# Altium project TI Project.PrjPCB (part 2 of 4)

## Sheet Monitoring & CB.SchDoc
size 431 x 279 mm; Date: Not shown in title block; ApprovedBy: Not shown in title block; CheckedBy: Not shown in title block; Author: Not shown in title block; CompanyName: Not shown in title block; Engineer: Not shown in title block; Organization: Not shown in title block; Address1: Not shown in title block; Address2: Not shown in title block; Address3: Not shown in title block; Address4: Not shown in title block; DocumentNumber: 1; Revision: Use project parameter SCH_Rev; SheetNumber: 2; SheetTotal: 3; PageSetup: Record=PageOptions|CenterHorizontal=True|CenterVertical=True|PrintScale=1.00|XCorrection=1.00|YCorrection=1.00|PrintKind=0|BorderSize=5000000|LeftOffset=0|BottomOffset=0|Orientation=2|PaperLength=1000|PaperWidth=1000|Scale=100|PaperSource=15|PrintQuality=600|MediaType=1|DitherType=10|PaperKind=Letter|PrintScaleMode=1; CurrentTime: Not shown in title block; CurrentDate: Not shown in title block; Time: Not shown in title block; DocumentFullPathAndName: Not shown in title block; DocumentName: Not shown in title block; ModifiedDate: Not shown in title block; ImagePath: Not shown in title block
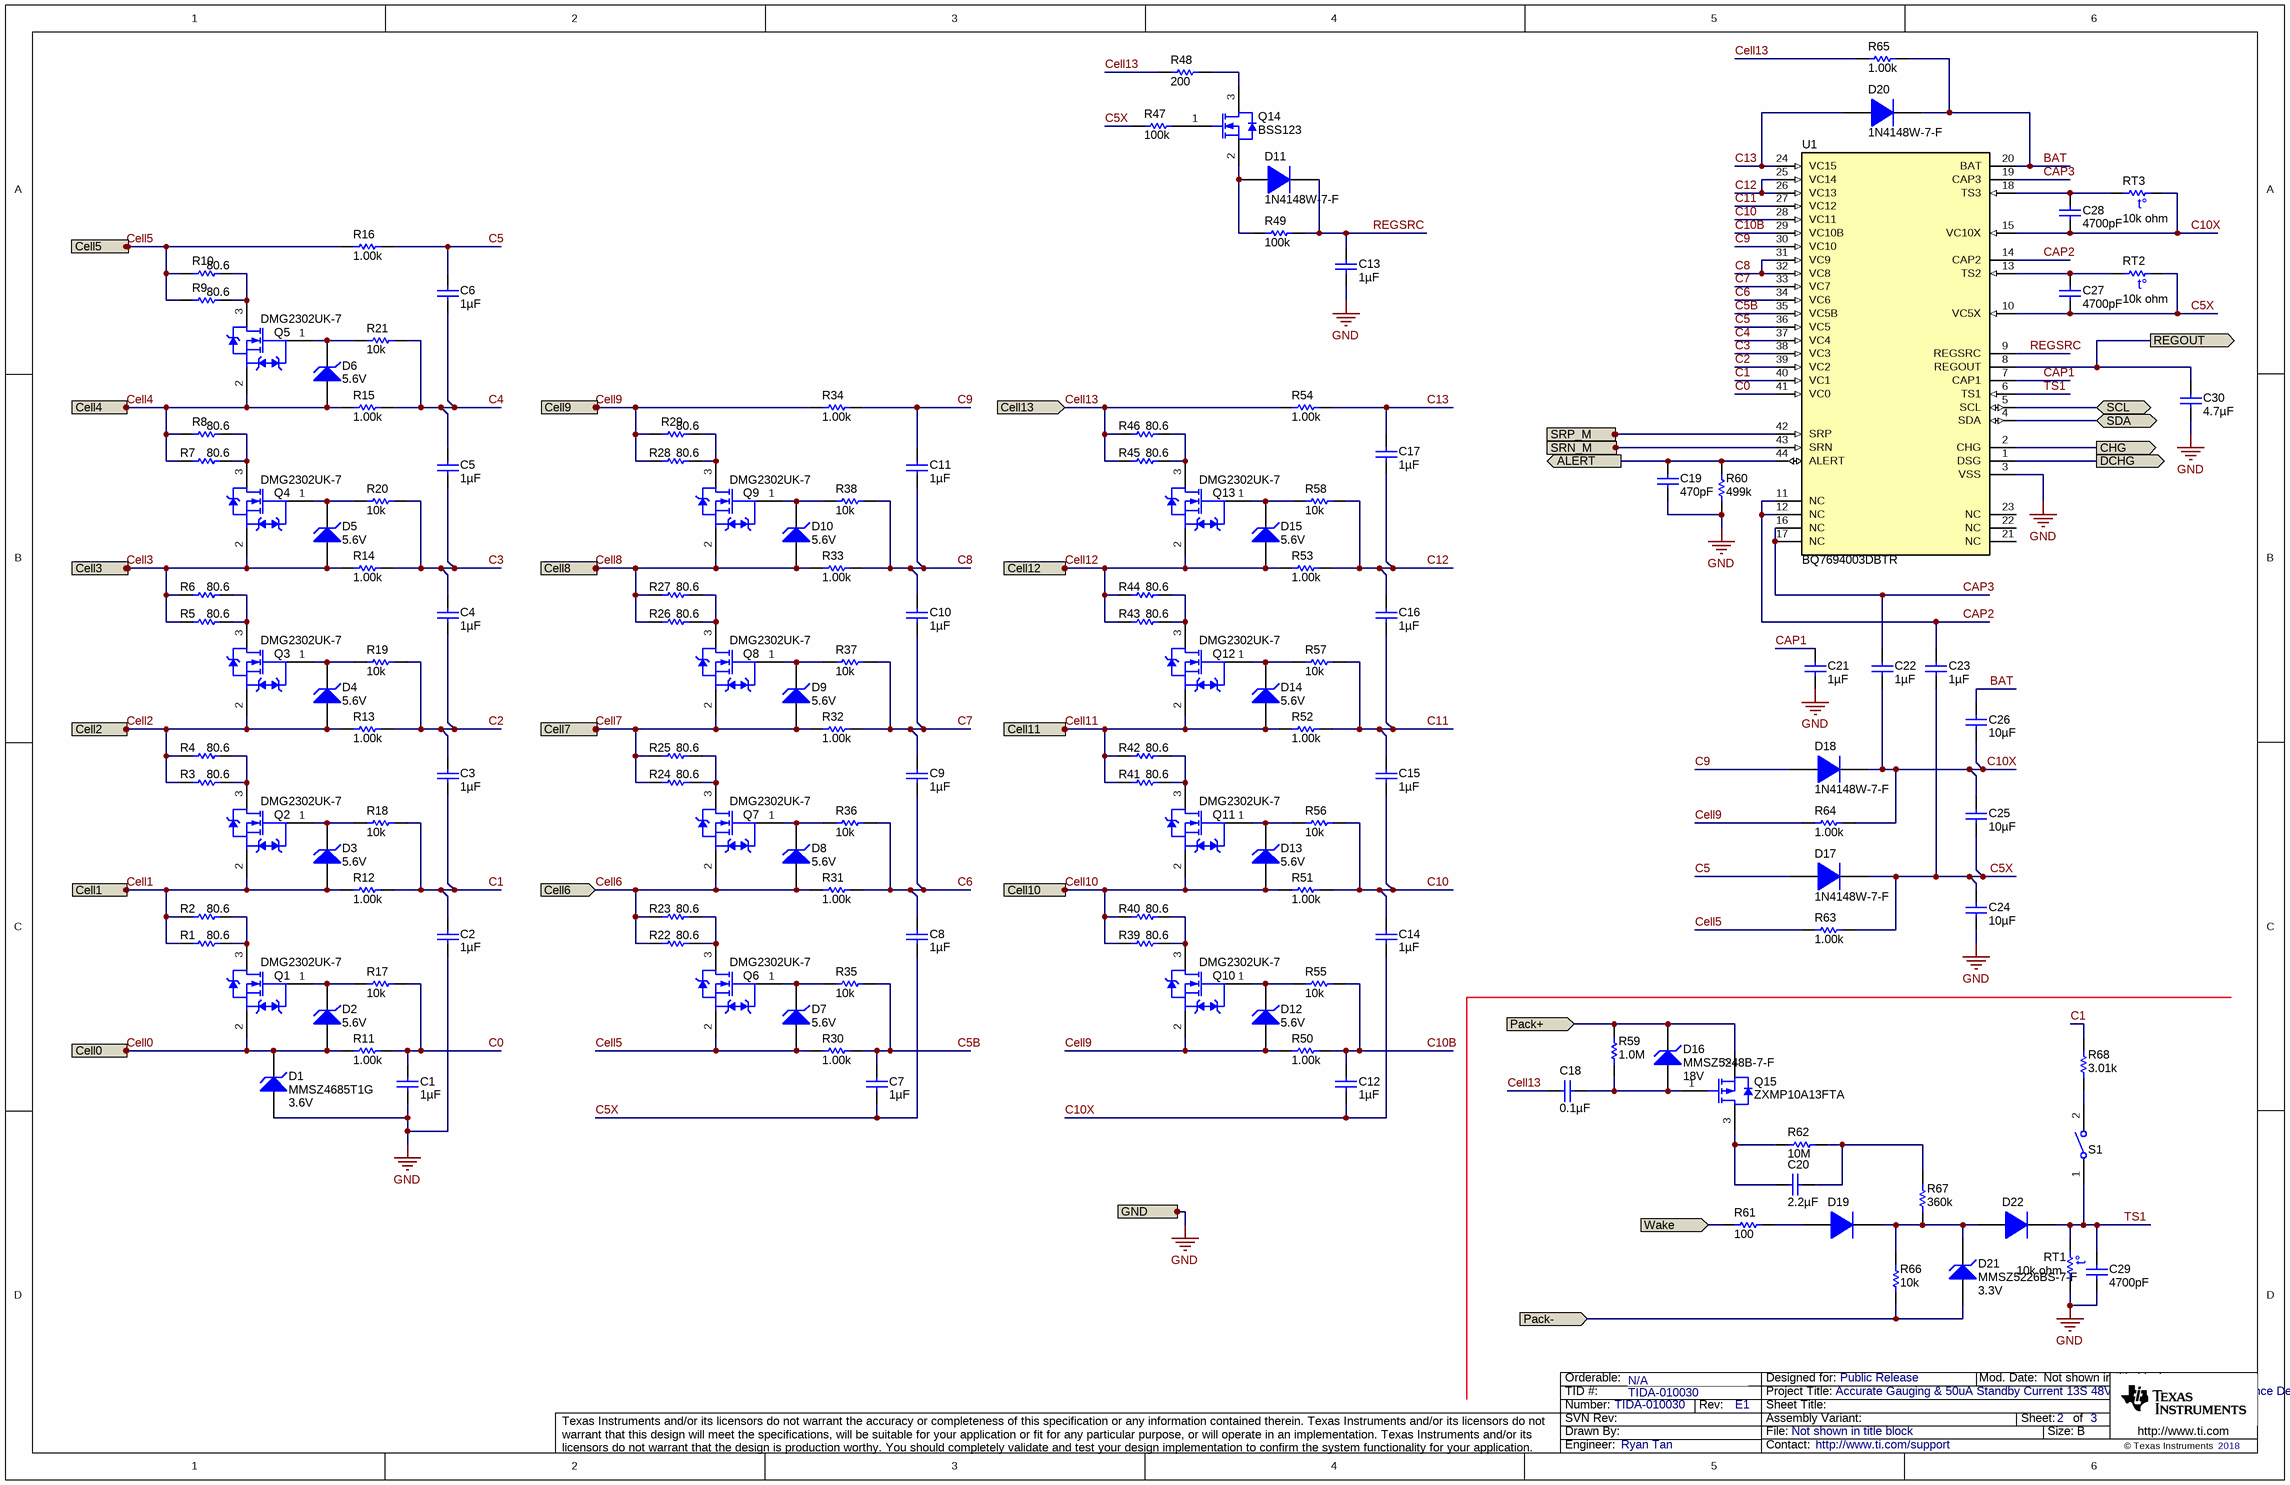
[diagram p1: Monitoring & CB.SchDoc]

### Parts
C1  ValueDisplayed: 1µF  [0603]  (hidden comment: GRM188R71C105KE15D)
C2  ValueDisplayed: 1µF  [0603S]  (hidden comment: GRM188R71C105KE15D)
C3  ValueDisplayed: 1µF  [0603]  (hidden comment: GRM188R71C105KE15D)
C4  ValueDisplayed: 1µF  [0603]  (hidden comment: GRM188R71C105KE15D)
C5  ValueDisplayed: 1µF  [0603]  (hidden comment: GRM188R71C105KE15D)
C6  ValueDisplayed: 1µF  [0603]  (hidden comment: GRM188R71C105KE15D)
C7  ValueDisplayed: 1µF  [0603S]  (hidden comment: GRM188R71C105KE15D)
C8  ValueDisplayed: 1µF  [0603S]  (hidden comment: GRM188R71C105KE15D)
C9  ValueDisplayed: 1µF  [0603]  (hidden comment: GRM188R71C105KE15D)
C10  ValueDisplayed: 1µF  [0603]  (hidden comment: GRM188R71C105KE15D)
C11  ValueDisplayed: 1µF  [0603]  (hidden comment: GRM188R71C105KE15D)
C12  ValueDisplayed: 1µF  [0603]  (hidden comment: GRM188R71C105KE15D)
C13  ValueDisplayed: 1µF  [0603S]  (hidden comment: C1608X7R1V105K080AC)
C14  ValueDisplayed: 1µF  [0603]  (hidden comment: GRM188R71C105KE15D)
C15  ValueDisplayed: 1µF  [0603]  (hidden comment: GRM188R71C105KE15D)
C16  ValueDisplayed: 1µF  [0603]  (hidden comment: GRM188R71C105KE15D)
C17  ValueDisplayed: 1µF  [0603]  (hidden comment: GRM188R71C105KE15D)
C18  ValueDisplayed: 0.1µF  [0805_HV]  (hidden comment: CGA4J2X7R2A104K125AA)
C19  ValueDisplayed: 470pF  [0603]  (hidden comment: GCM1885C1H471JA16D)
C20  ValueDisplayed: 2.2µF  [1210_270]  (hidden comment: GRM32ER72A225KA35L)
C21  ValueDisplayed: 1µF  [0603S]  (hidden comment: GRM188R71C105KE15D)
C22  ValueDisplayed: 1µF  [0603S]  (hidden comment: GRM188R71C105KE15D)
C23  ValueDisplayed: 1µF  [0603S]  (hidden comment: GRM188R71C105KE15D)
C24  ValueDisplayed: 10µF  [1210_280]  (hidden comment: C3225X5R1H106K250AB)
C25  ValueDisplayed: 10µF  [1210_280]  (hidden comment: C3225X5R1H106K250AB)
C26  ValueDisplayed: 10µF  [1210_280]  (hidden comment: C3225X5R1H106K250AB)
C27  ValueDisplayed: 4700pF  [0603S]  (hidden comment: GCM188R71H472KA37D)
C28  ValueDisplayed: 4700pF  [0603]  (hidden comment: GCM188R71H472KA37D)
C29  ValueDisplayed: 4700pF  [0603]  (hidden comment: GCM188R71H472KA37D)
C30  ValueDisplayed: 4.7µF  [0603S]  (hidden comment: GRM188R61C475KAAJ)
D1  MMSZ4685T1G  value 3.6V  [SOD-123]
D2  value 5.6V  [SOD-523]  (hidden comment: BZT52C5V6T-7)
D3  value 5.6V  [SOD-523]  (hidden comment: BZT52C5V6T-7)
D4  value 5.6V  [SOD-523]  (hidden comment: BZT52C5V6T-7)
D5  value 5.6V  [SOD-523]  (hidden comment: BZT52C5V6T-7)
D6  value 5.6V  [SOD-523]  (hidden comment: BZT52C5V6T-7)
D7  value 5.6V  [SOD-523]  (hidden comment: BZT52C5V6T-7)
D8  value 5.6V  [SOD-523]  (hidden comment: BZT52C5V6T-7)
D9  value 5.6V  [SOD-523]  (hidden comment: BZT52C5V6T-7)
D10  value 5.6V  [SOD-523]  (hidden comment: BZT52C5V6T-7)
D11  1N4148W-7-F  [SOD-123]
D12  value 5.6V  [SOD-523]  (hidden comment: BZT52C5V6T-7)
D13  value 5.6V  [SOD-523]  (hidden comment: BZT52C5V6T-7)
D14  value 5.6V  [SOD-523]  (hidden comment: BZT52C5V6T-7)
D15  value 5.6V  [SOD-523]  (hidden comment: BZT52C5V6T-7)
D16  MMSZ5248B-7-F  value 18V  [SOD-123]
D17  1N4148W-7-F  [SOD-123]
D18  1N4148W-7-F  [SOD-123]
D19  SBR0220T5-7  [SOD-523]  (value not drawn)
D20  1N4148W-7-F  [SOD-123]
D21  MMSZ5226BS-7-F  value 3.3V  [SOD-323]
D22  SBR0220T5-7  [SOD-523]  (value not drawn)
Q1  DMG2302UK-7  [SOT-23]
Q2  DMG2302UK-7  [SOT-23]
Q3  DMG2302UK-7  [SOT-23]
Q4  DMG2302UK-7  [SOT-23]
Q5  DMG2302UK-7  [SOT-23]
Q6  DMG2302UK-7  [SOT-23]
Q7  DMG2302UK-7  [SOT-23]
Q8  DMG2302UK-7  [SOT-23]
Q9  DMG2302UK-7  [SOT-23]
Q10  DMG2302UK-7  [SOT-23]
Q11  DMG2302UK-7  [SOT-23]
Q12  DMG2302UK-7  [SOT-23]
Q13  DMG2302UK-7  [SOT-23]
Q14  BSS123  [SOT-23]
Q15  ZXMP10A13FTA  [SOT-23]
R1  ValueDisplayed: 80.6  [1206]  (hidden comment: CRCW120680R6FKEA)
R2  ValueDisplayed: 80.6  [1206]  (hidden comment: CRCW120680R6FKEA)
R3  ValueDisplayed: 80.6  [1206]  (hidden comment: CRCW120680R6FKEA)
R4  ValueDisplayed: 80.6  [1206]  (hidden comment: CRCW120680R6FKEA)
R5  ValueDisplayed: 80.6  [1206]  (hidden comment: CRCW120680R6FKEA)
R6  ValueDisplayed: 80.6  [1206]  (hidden comment: CRCW120680R6FKEA)
R7  ValueDisplayed: 80.6  [1206]  (hidden comment: CRCW120680R6FKEA)
R8  ValueDisplayed: 80.6  [1206]  (hidden comment: CRCW120680R6FKEA)
R9  ValueDisplayed: 80.6  [1206]  (hidden comment: CRCW120680R6FKEA)
R10  ValueDisplayed: 80.6  [1206]  (hidden comment: CRCW120680R6FKEA)
R11  ValueDisplayed: 1.00k  [0603]  (hidden comment: CRCW06031K00FKEA)
R12  ValueDisplayed: 1.00k  [0603]  (hidden comment: CRCW06031K00FKEA)
R13  ValueDisplayed: 1.00k  [0603]  (hidden comment: CRCW06031K00FKEA)
R14  ValueDisplayed: 1.00k  [0603]  (hidden comment: CRCW06031K00FKEA)
R15  ValueDisplayed: 1.00k  [0603]  (hidden comment: CRCW06031K00FKEA)
R16  ValueDisplayed: 1.00k  [0603]  (hidden comment: CRCW06031K00FKEA)
R17  ValueDisplayed: 10k  [0603]  (hidden comment: CRCW060310K0JNEA)
R18  ValueDisplayed: 10k  [0603]  (hidden comment: CRCW060310K0JNEA)
R19  ValueDisplayed: 10k  [0603]  (hidden comment: CRCW060310K0JNEA)
R20  ValueDisplayed: 10k  [0603]  (hidden comment: CRCW060310K0JNEA)
R21  ValueDisplayed: 10k  [0603]  (hidden comment: CRCW060310K0JNEA)
R22  ValueDisplayed: 80.6  [1206]  (hidden comment: CRCW120680R6FKEA)
R23  ValueDisplayed: 80.6  [1206]  (hidden comment: CRCW120680R6FKEA)
R24  ValueDisplayed: 80.6  [1206]  (hidden comment: CRCW120680R6FKEA)
R25  ValueDisplayed: 80.6  [1206]  (hidden comment: CRCW120680R6FKEA)
R26  ValueDisplayed: 80.6  [1206]  (hidden comment: CRCW120680R6FKEA)
R27  ValueDisplayed: 80.6  [1206]  (hidden comment: CRCW120680R6FKEA)
R28  ValueDisplayed: 80.6  [1206]  (hidden comment: CRCW120680R6FKEA)
R29  ValueDisplayed: 80.6  [1206]  (hidden comment: CRCW120680R6FKEA)
R30  ValueDisplayed: 1.00k  [0603]  (hidden comment: CRCW06031K00FKEA)
R31  ValueDisplayed: 1.00k  [0603]  (hidden comment: CRCW06031K00FKEA)
R32  ValueDisplayed: 1.00k  [0603]  (hidden comment: CRCW06031K00FKEA)
R33  ValueDisplayed: 1.00k  [0603]  (hidden comment: CRCW06031K00FKEA)
R34  ValueDisplayed: 1.00k  [0603]  (hidden comment: CRCW06031K00FKEA)
R35  ValueDisplayed: 10k  [0603]  (hidden comment: CRCW060310K0JNEA)
R36  ValueDisplayed: 10k  [0603]  (hidden comment: CRCW060310K0JNEA)
R37  ValueDisplayed: 10k  [0603]  (hidden comment: CRCW060310K0JNEA)
R38  ValueDisplayed: 10k  [0603]  (hidden comment: CRCW060310K0JNEA)
R39  ValueDisplayed: 80.6  [1206]  (hidden comment: CRCW120680R6FKEA)
R40  ValueDisplayed: 80.6  [1206]  (hidden comment: CRCW120680R6FKEA)
R41  ValueDisplayed: 80.6  [1206]  (hidden comment: CRCW120680R6FKEA)
R42  ValueDisplayed: 80.6  [1206]  (hidden comment: CRCW120680R6FKEA)
R43  ValueDisplayed: 80.6  [1206]  (hidden comment: CRCW120680R6FKEA)
R44  ValueDisplayed: 80.6  [1206]  (hidden comment: CRCW120680R6FKEA)
R45  ValueDisplayed: 80.6  [1206]  (hidden comment: CRCW120680R6FKEA)
R46  ValueDisplayed: 80.6  [1206]  (hidden comment: CRCW120680R6FKEA)
R47  ValueDisplayed: 100k  [0603]  (hidden comment: CRCW0603100KFKEA)
R48  ValueDisplayed: 200  [0603]  (hidden comment: CRCW0603200RFKEA)
R49  ValueDisplayed: 100k  [0603]  (hidden comment: CRCW0603100KFKEA)
R50  ValueDisplayed: 1.00k  [0603]  (hidden comment: CRCW06031K00FKEA)
R51  ValueDisplayed: 1.00k  [0603]  (hidden comment: CRCW06031K00FKEA)
R52  ValueDisplayed: 1.00k  [0603]  (hidden comment: CRCW06031K00FKEA)
R53  ValueDisplayed: 1.00k  [0603]  (hidden comment: CRCW06031K00FKEA)
R54  ValueDisplayed: 1.00k  [0603]  (hidden comment: CRCW06031K00FKEA)
R55  ValueDisplayed: 10k  [0603]  (hidden comment: CRCW060310K0JNEA)
R56  ValueDisplayed: 10k  [0603]  (hidden comment: CRCW060310K0JNEA)
R57  ValueDisplayed: 10k  [0603]  (hidden comment: CRCW060310K0JNEA)
R58  ValueDisplayed: 10k  [0603]  (hidden comment: CRCW060310K0JNEA)
R59  ValueDisplayed: 1.0M  [0603]  (hidden comment: CRCW06031M00JNEA)
R60  ValueDisplayed: 499k  [0603]  (hidden comment: CRCW0603499KFKEA)
R61  ValueDisplayed: 100  [0603]  (hidden comment: CRCW0603100RFKEA)
R62  ValueDisplayed: 10M  [0603]  (hidden comment: CRCW060310M0JNEA)
R63  ValueDisplayed: 1.00k  [0603]  (hidden comment: CRCW06031K00FKEA)
R64  ValueDisplayed: 1.00k  [0603]  (hidden comment: CRCW06031K00FKEA)
R65  ValueDisplayed: 1.00k  [0603]  (hidden comment: CRCW06031K00FKEA)
R66  ValueDisplayed: 10k  [0603]  (hidden comment: CRCW060310K0JNEA)
R67  ValueDisplayed: 360k  [0603]  (hidden comment: ERJ-3EKF3603V)
R68  ValueDisplayed: 3.01k  [0603S]  (hidden comment: CRCW06033K01FKEA)
RT1  value 10k ohm  [NTCALUG03]  (hidden comment: NTCALUG03A103G)
RT2  value 10k ohm  [NTCALUG03]  (hidden comment: NTCALUG03A103G)
RT3  value 10k ohm  [NTCALUG03]  (hidden comment: NTCALUG03A103G)
S1  RS-032G05A3-SM RT  [SW_RS-032G05A3-SM]  (value not drawn)
U1  BQ7694003DBTR  [DBT0044A_N]

### Ports
ALERT (out), Cell0 (in), Cell1 (in), Cell2 (in), Cell3 (in), Cell4 (in), Cell5 (in), Cell6 (in), Cell7 (in), Cell8 (in), Cell9 (in), Cell10 (in), Cell11 (in), Cell12 (in), Cell13 (in), CHG (out), DCHG (out), GND, Pack+ (in), Pack- (in), REGOUT (out), SCL (bidir), SDA (bidir), SRN_M (in), SRP_M (in), Wake (in)

### Nets
GND: C1.2 C2.2 C13.2 C19.2 C21.2 C24.1 C29.2 C30.2 D1.2(A) R60.1 RT1.1 U1.3(VSS) ; port GND
ALERT: C19.1 R60.2 U1.44(ALERT) ; port ALERT
BAT: C26.2 D20.1(K) R65.2 U1.20(BAT)
C0: C1.1 R11.2 R17.2 U1.41(VC0)
C1: C2.1 C3.2 R12.2 R18.2 R68.2 U1.40(VC1)
C2: C3.1 C4.2 R13.2 R19.2 U1.39(VC2)
C3: C4.1 C5.2 R14.2 R20.2 U1.38(VC3)
C4: C5.1 C6.2 R15.2 R21.2 U1.37(VC4)
C5: C6.1 D17.2(A) R16.2 U1.36(VC5)
C5B: C7.1 R30.2 R35.2 U1.35(VC5B)
C5X: C7.2 C8.2 C23.2 C24.2 C25.1 C27.2 D17.1(K) R47.1 R63.2 RT2.2 U1.10(VC5X)
C6: C8.1 C9.2 R31.2 R36.2 U1.34(VC6)
C7: C9.1 C10.2 R32.2 R37.2 U1.33(VC7)
C8: C10.1 C11.2 R33.2 R38.2 U1.31(VC9) U1.32(VC8)
C9: C11.1 D18.2(A) R34.2 U1.30(VC10)
C10: C14.1 C15.2 R51.2 R56.2 U1.28(VC11)
C10B: C12.1 R50.2 R55.2 U1.29(VC10B)
C10X: C12.2 C14.2 C22.2 C25.2 C26.1 C28.2 D18.1(K) R64.2 RT3.2 U1.15(VC10X)
C11: C15.1 C16.2 R52.2 R57.2 U1.27(VC12)
C12: C16.1 C17.2 R53.2 R58.2 U1.25(VC14) U1.26(VC13)
C13: C17.1 D20.2(A) R54.2 U1.24(VC15)
CAP1: C21.1 U1.7(CAP1)
CAP2: C23.1 U1.11(NC) U1.12(NC) U1.14(CAP2)
CAP3: C22.1 U1.16(NC) U1.17(NC) U1.19(CAP3)
Cell0: D1.1(K) D2.2(A) Q1.2(S) R11.1 ; port Cell0
Cell1: D3.2(A) Q2.2(S) R1.2 R2.2 R12.1 ; port Cell1
Cell2: D4.2(A) Q3.2(S) R3.2 R4.2 R13.1 ; port Cell2
Cell3: D5.2(A) Q4.2(S) R5.2 R6.2 R14.1 ; port Cell3
Cell4: D6.2(A) Q5.2(S) R7.2 R8.2 R15.1 ; port Cell4
Cell5: D7.2(A) Q6.2(S) R9.2 R10.2 R16.1 R30.1 R63.1 ; port Cell5
Cell6: D8.2(A) Q7.2(S) R22.2 R23.2 R31.1 ; port Cell6
Cell7: D9.2(A) Q8.2(S) R24.2 R25.2 R32.1 ; port Cell7
Cell8: D10.2(A) Q9.2(S) R26.2 R27.2 R33.1 ; port Cell8
Cell9: D12.2(A) Q10.2(S) R28.2 R29.2 R34.1 R50.1 R64.1 ; port Cell9
Cell10: D13.2(A) Q11.2(S) R39.2 R40.2 R51.1 ; port Cell10
Cell11: D14.2(A) Q12.2(S) R41.2 R42.2 R52.1 ; port Cell11
Cell12: D15.2(A) Q13.2(S) R43.2 R44.2 R53.1 ; port Cell12
Cell13: C18.2 R45.2 R46.2 R48.1 R54.1 R65.1 ; port Cell13
CHG: U1.2(CHG) ; port CHG
DCHG: U1.1(DSG) ; port DCHG
Pack+: D16.1(K) Q15.2(S) R59.2 ; port Pack+
Pack-: D21.2(A) R66.1 ; port Pack-
REGOUT: C30.1 U1.8(REGOUT) ; port REGOUT
REGSRC: C13.1 D11.1(K) R49.2 U1.9(REGSRC)
SCL: U1.5(SCL) ; port SCL
SDA: U1.4(SDA) ; port SDA
SRN_M: U1.43(SRN) ; port SRN_M
SRP_M: U1.42(SRP) ; port SRP_M
TS1: C29.1 D22.1(K) RT1.2 S1.1 U1.6(TS1)
Wake: R61.2 ; port Wake
NetC18_1: C18.1 D16.2(A) Q15.1(G) R59.1
NetC20_1: C20.1 R62.2 R67.2
NetC20_2: C20.2 Q15.3(D) R62.1
NetC27_1: C27.1 RT2.1 U1.13(TS2)
NetC28_1: C28.1 RT3.1 U1.18(TS3)
NetD2_1: D2.1(K) Q1.1(G) R17.1
NetD3_1: D3.1(K) Q2.1(G) R18.1
NetD4_1: D4.1(K) Q3.1(G) R19.1
NetD5_1: D5.1(K) Q4.1(G) R20.1
NetD6_1: D6.1(K) Q5.1(G) R21.1
NetD7_1: D7.1(K) Q6.1(G) R35.1
NetD8_1: D8.1(K) Q7.1(G) R36.1
NetD9_1: D9.1(K) Q8.1(G) R37.1
NetD10_1: D10.1(K) Q9.1(G) R38.1
NetD11_2: D11.2(A) Q14.2(S) R49.1
NetD12_1: D12.1(K) Q10.1(G) R55.1
NetD13_1: D13.1(K) Q11.1(G) R56.1
NetD14_1: D14.1(K) Q12.1(G) R57.1
NetD15_1: D15.1(K) Q13.1(G) R58.1
NetD19_1: D19.1(K) D21.1(K) D22.2(A) R66.2 R67.1
NetD19_2: D19.2(A) R61.1
NetQ1_3: Q1.3(D) R1.1 R2.1
NetQ2_3: Q2.3(D) R3.1 R4.1
NetQ3_3: Q3.3(D) R5.1 R6.1
NetQ4_3: Q4.3(D) R7.1 R8.1
NetQ5_3: Q5.3(D) R9.1 R10.1
NetQ6_3: Q6.3(D) R22.1 R23.1
NetQ7_3: Q7.3(D) R24.1 R25.1
NetQ8_3: Q8.3(D) R26.1 R27.1
NetQ9_3: Q9.3(D) R28.1 R29.1
NetQ10_3: Q10.3(D) R39.1 R40.1
NetQ11_3: Q11.3(D) R41.1 R42.1
NetQ12_3: Q12.3(D) R43.1 R44.1
NetQ13_3: Q13.3(D) R45.1 R46.1
NetQ14_1: Q14.1(G) R47.2
NetQ14_3: Q14.3(D) R48.2
NetR68_1: R68.1 S1.2

Not connected (* = marked no-connect by the designer): U1 21(NC) 22(NC) 23(NC)

### Notes on the sheet
- N/A
- Drawn By:
- SVN Rev:
- Number:
- TID #:
- Orderable:
- Rev:
- Sheet Title:
- File:
- Project Title:
- Designed for:
- Assembly Variant:
- Mod. Date:
- Sheet:
- Size:
- of
- B
- http://www.ti.com
- Texas Instruments and/or its licensors do not warrant the accuracy or completeness of this specification or any information contained therein. Texas Instruments and/or its licensors do not warrant that this design will meet the specifications, will be suitable for your application or fit for any particular purpose, or will operate in an implementation. Texas Instruments and/or its licensors do not warrant that the design is production worthy. You should completely validate and test your design implementation to confirm the system functionality for your application.
- Engineer:
- Contact:
- © Texas Instruments
- (in symbol NTCALUG03A103G) t°

### Library data of the parts
C1 C3-C6 C9-C12 C14-C17 = GRM188R71C105KE15D: CAP, CERM, 1 µF, 16 V,+/- 10%, X7R, 0603; Manufacturer: MuRata; Polarized: N; CompType: Capacitor; Value: 1uF; U/M: EA; Cap_F: 0.000001; Tolerance_%: 10; VDC_V: 16; Value2: 16V; TaMin_C: -55; TaMax_C: 125; SizeArea_mm2: 1.28; SizeAreaWB_mm2: 4.68; SizeX_mm: 1.6; SizeY_mm: 0.8; SizeZ_mm: 1; AEC Category: Q200; SymbolVersion: 2008-07-09; PartNumber: GRM188R71C105KE15D; PackageReference: 0603; RoHS: Y; MountType: SMT; Technology: Ceramic; TempCo: X7R; Cap_Case: 0603; Published: 2008-06-19; Publisher: Texas Instruments; LatestRevisionDate: 2017-06-22; ComponentLink1Description: Datasheet link; ComponentLink1URL: http://search.murata.co.jp/Ceramy/image/img/A01X/G101/ENG/GRM188R71C105KE15-01.pdf; Supplier 1: Digi-Key; Supplier Part Number 1: 490-10734-1-ND; Supplier 2: Mouser; Supplier Part Number 2: 81-GRM188R71C105KE5D; AEC Qualified: N; AEC Grade: N/A
C2 C7 C8 C21-C23 = GRM188R71C105KE15D: CAP, CERM, 1 µF, 16 V,+/- 10%, X7R, 0603; Manufacturer: MuRata; Polarized: N; CompType: Capacitor; Value: 1uF; U/M: EA; Cap_F: 0.000001; Tolerance_%: 10; VDC_V: 16; Value2: 16V; TaMin_C: -55; TaMax_C: 125; Cap_Case: 0603; SizeArea_mm2: 1.28; SizeAreaWB_mm2: 4.68; SizeX_mm: 1.6; SizeY_mm: 0.8; SizeZ_mm: 1; AEC Category: Q200; SymbolVersion: 2008-07-09; PartNumber: GRM188R71C105KE15D; PackageReference: 0603; RoHS: Y; MountType: SMT; Technology: Ceramic; TempCo: X7R; Published: 2008-06-19; Publisher: Texas Instruments; LatestRevisionDate: 2017-06-22; ComponentLink1Description: Datasheet link; ComponentLink1URL: http://search.murata.co.jp/Ceramy/image/img/A01X/G101/ENG/GRM188R71C105KE15-01.pdf; Supplier 1: Digi-Key; Supplier Part Number 1: 490-10734-1-ND; Supplier 2: Mouser; Supplier Part Number 2: 81-GRM188R71C105KE5D; AEC Qualified: N; AEC Grade: N/A
C13 = C1608X7R1V105K080AC: CAP, CERM, 1 µF, 35 V,+/- 10%, X7R, 0603; Manufacturer: TDK; Polarized: N; CompType: Capacitor; Value: 1uF; U/M: EA; Cap_F: 0.000001; Tolerance_%: 10; VDC_V: 35; Value2: 35V; TaMin_C: -55; TaMax_C: 125; Cap_Case: 0603; SizeArea_mm2: 1.28; SizeAreaWB_mm2: 4.68; SizeX_mm: 1.6; SizeY_mm: 0.8; SizeZ_mm: 1; AEC Category: Q200; Green_Lifecycle: Active; Green_REACh: Passed; SymbolVersion: 2008-07-09; PartNumber: C1608X7R1V105K080AC; PackageReference: 0603; RoHS: Y; MountType: SMT; Technology: Ceramic; TempCo: X7R; Published: 2008-06-19; Publisher: Texas Instruments; LatestRevisionDate: 2017-06-22; ComponentLink1Description: Datasheet link; ComponentLink1URL: http://product.tdk.com/en/catalog/datasheets/mlcc_commercial_general_en.pdf; Supplier 1: Digi-Key; Supplier Part Number 1: 445-7414-1-ND; Supplier 2: Newark; Supplier Part Number 2: 05X9860; Supplier 3: Mouser; Supplier Part Number 3: 810-C1608X7R1V105KAC; AEC Qualified: N; AEC Grade: N/A; Green_EU RoHS: Passed; Green_EU RoHS-2: Passed
C18 = CGA4J2X7R2A104K125AA: CAP, CERM, 0.1 µF, 100 V,+/- 10%, X7R, AEC-Q200 Grade 1, 0805; Manufacturer: TDK; Polarized: N; CompType: Capacitor; Value: 0.1uF; U/M: EA; Cap_F: 0.0000001; Tolerance_%: 10; ESR_ohm: 0.020726; Value1: 0.020726 ohm; VDC_V: 100; Value2: 100V; IRMS_A: 1.456; TaMin_C: -55; TaMax_C: 125; Cap_Case: 0805; SizeArea_mm2: 2.5; SizeAreaWB_mm2: 6.75; SizeX_mm: 2; SizeY_mm: 1.25; SizeZ_mm: 1.45; AEC Category: Q200; AEC Qualified: Y; AEC Grade: 1; Green_Lifecycle: Active; Green_REACh: Passed; SymbolVersion: 2008-07-09; PartNumber: CGA4J2X7R2A104K125AA; PackageReference: 0805; RoHS: Y; MountType: SMT; Technology: Ceramic; TempCo: X7R; Published: 2008-06-19; Publisher: Texas Instruments; LatestRevisionDate: 2017-06-22; ComponentLink1Description: Datasheet link; ComponentLink1URL: https://product.tdk.com/en/search/capacitor/ceramic/mlcc/info?part_no=CGA4J2X7R2A104K125AA; Supplier 1: Digi-Key; Supplier Part Number 1: 445-5827-1-ND; Supplier 2: Mouser; Supplier Part Number 2: 810-CGA4J2X7R2A104K125AA; Green_EU RoHS: Passed; Green_EU RoHS-2: Passed
C19 = GCM1885C1H471JA16D: CAP, CERM, 470 pF, 50 V,+/- 5%, C0G/NP0, AEC-Q200 Grade 1, 0603; Manufacturer: MuRata; Polarized: N; CompType: Capacitor; Value: 470pF; U/M: EA; Cap_F: 0.00000000047; Tolerance_%: 5; VDC_V: 50; Value2: 50V; TaMin_C: -55; TaMax_C: 125; SizeArea_mm2: 1.28; SizeAreaWB_mm2: 4.68; SizeX_mm: 1.6; SizeY_mm: 0.8; SizeZ_mm: 1; AEC Category: Q200; AEC Qualified: Y; Green_Lifecycle: Active; Green_REACh: Passed; SymbolVersion: 2008-07-09; PartNumber: GCM1885C1H471JA16D; PackageReference: 0603; RoHS: Y; MountType: SMT; Technology: Ceramic; TempCo: C0G/NP0; Cap_Case: 0603; Published: 2008-06-19; Publisher: Texas Instruments; LatestRevisionDate: 2017-06-22; ComponentLink1Description: Datasheet link; ComponentLink1URL: http://psearch.murata.com/capacitor/product/GCM1885C1H471JA16%23.pdf; Supplier 1: Digi-Key; Supplier Part Number 1: 490-4965-1-ND; Supplier 2: Mouser; Supplier Part Number 2: 81-GCM1885C1H471J16D; AEC Grade: 1; Green_EU RoHS: Passed; Green_EU RoHS-2: Incomplete
C20 = GRM32ER72A225KA35L: CAP, CERM, 2.2 µF, 100 V,+/- 10%, X7R, 1210; Manufacturer: MuRata; Polarized: N; CompType: Capacitor; Value: 2.2uF; U/M: EA; Cap_F: 0.0000022; Tolerance_%: 10; ESR_ohm: 0.007; Value1: 0.007 ohm; VDC_V: 100; Value2: 100V; IRMS_A: 4.4; TaMin_C: -55; TaMax_C: 125; Cap_Case: 1210; SizeArea_mm2: 8; SizeAreaWB_mm2: 14.7; SizeX_mm: 3.2; SizeY_mm: 2.5; SizeZ_mm: 2.7; AEC Category: Q200; Green_Lifecycle: Active; Green_REACh: Passed; SymbolVersion: 2008-07-09; PartNumber: GRM32ER72A225KA35L; PackageReference: 1210; RoHS: Y; MountType: SMT; Technology: Ceramic; TempCo: X7R; Published: 2008-06-19; Publisher: Texas Instruments; LatestRevisionDate: 2017-06-22; ComponentLink1Description: Datasheet link; ComponentLink1URL: http://search.murata.co.jp/Ceramy/PnsearchViewAction.do?HnOFG=ON&HnNFG=ON&SEL_CNT=50&sLang=en&sKey=GRM32ER72A225KA35L&x=9&y=9&search=startwith; Supplier 1: Digi-Key; Supplier Part Number 1: 490-3385-1-ND; Supplier 2: Mouser; Supplier Part Number 2: 81-GRM32ER72A225KA35; Supplier 3: Farnell; Supplier Part Number 3: 1735547; AEC Qualified: ?; Green_EU RoHS: Passed; Green_EU RoHS-2: Passed
C24-C26 = C3225X5R1H106K250AB: CAP, CERM, 10 µF, 50 V,+/- 10%, X5R, 1210; Manufacturer: TDK; Polarized: N; CompType: Capacitor; Value: 10uF; U/M: EA; Cap_F: 0.00001; Tolerance_%: 10; VDC_V: 50; Value2: 50V; TaMin_C: -55; TaMax_C: 85; Cap_Case: 1210; SizeArea_mm2: 8; SizeAreaWB_mm2: 14.7; SizeX_mm: 3.2; SizeY_mm: 2.5; SizeZ_mm: 2.8; AEC Category: Q200; Green_Lifecycle: Active; Green_REACh: Passed; SymbolVersion: 2008-07-09; PartNumber: C3225X5R1H106K250AB; PackageReference: 1210; RoHS: Y; MountType: SMT; Technology: Ceramic; TempCo: X5R; Published: 2008-06-19; Publisher: Texas Instruments; LatestRevisionDate: 2017-06-22; ComponentLink1Description: Datasheet link; ComponentLink1URL: https://product.tdk.com/info/en/catalog/datasheets/mlcc_commercial_general_en.pdf; Supplier 1: Digi-Key; Supplier Part Number 1: 445-9074-6-ND; Supplier 2: Newark; Supplier Part Number 2: 07W9219; Supplier 3: Mouser; Supplier Part Number 3: 810-C3225X5R1H106K; AEC Qualified: N; AEC Grade: N/A; Green_EU RoHS: Passed; Green_EU RoHS-2: Passed
C27 = GCM188R71H472KA37D: CAP, CERM, 4700 pF, 50 V,+/- 10%, X7R, AEC-Q200 Grade 1, 0603; Manufacturer: MuRata; Polarized: N; CompType: Capacitor; Value: 4700pF; U/M: EA; Cap_F: 0.0000000047; Tolerance_%: 10; VDC_V: 50; Value2: 50V; TaMin_C: -55; TaMax_C: 125; Cap_Case: 0603; SizeArea_mm2: 1.28; SizeAreaWB_mm2: 4.68; SizeX_mm: 1.6; SizeY_mm: 0.8; SizeZ_mm: 1; AEC Category: Q200; AEC Qualified: Y; SymbolVersion: 2008-07-09; PartNumber: GCM188R71H472KA37D; PackageReference: 0603; RoHS: Y; MountType: SMT; Technology: Ceramic; TempCo: X7R; Published: 2008-06-19; Publisher: Texas Instruments; LatestRevisionDate: 2017-06-22; ComponentLink1Description: Datasheet link; ComponentLink1URL: http://psearch.murata.com/capacitor/product/GCM188R71H472KA37%23.pdf; Supplier 1: Digi-Key; Supplier Part Number 1: 490-4932-1-ND; Supplier 2: Mouser; Supplier Part Number 2: 81-GCM188R71H472K37D; AEC Grade: 1
C28 C29 = GCM188R71H472KA37D: CAP, CERM, 4700 pF, 50 V,+/- 10%, X7R, AEC-Q200 Grade 1, 0603; Manufacturer: MuRata; Polarized: N; CompType: Capacitor; Value: 4700pF; U/M: EA; Cap_F: 0.0000000047; Tolerance_%: 10; VDC_V: 50; Value2: 50V; TaMin_C: -55; TaMax_C: 125; SizeArea_mm2: 1.28; SizeAreaWB_mm2: 4.68; SizeX_mm: 1.6; SizeY_mm: 0.8; SizeZ_mm: 1; AEC Category: Q200; AEC Qualified: Y; SymbolVersion: 2008-07-09; PartNumber: GCM188R71H472KA37D; PackageReference: 0603; RoHS: Y; MountType: SMT; Technology: Ceramic; TempCo: X7R; Cap_Case: 0603; Published: 2008-06-19; Publisher: Texas Instruments; LatestRevisionDate: 2017-06-22; ComponentLink1Description: Datasheet link; ComponentLink1URL: http://psearch.murata.com/capacitor/product/GCM188R71H472KA37%23.pdf; Supplier 1: Digi-Key; Supplier Part Number 1: 490-4932-1-ND; Supplier 2: Mouser; Supplier Part Number 2: 81-GCM188R71H472K37D; AEC Grade: 1
C30 = GRM188R61C475KAAJ: CAP, CERM, 4.7 µF, 16 V,+/- 10%, X5R, 0603; Manufacturer: MuRata; Polarized: N; CompType: Capacitor; Value: 4.7uF; U/M: EA; Cap_F: 0.0000047; Tolerance_%: 10; VDC_V: 16; Value2: 16V; TaMin_C: -55; TaMax_C: 85; Cap_Case: 0603; SizeArea_mm2: 1.28; SizeAreaWB_mm2: 4.68; SizeX_mm: 1.6; SizeY_mm: 0.8; SizeZ_mm: 1; AEC Category: Q200; Green_Lifecycle: Active; Green_REACh: Passed; SymbolVersion: 2008-07-09; PartNumber: GRM188R61C475KAAJ; PackageReference: 0603; RoHS: Y; MountType: SMT; Technology: Ceramic; TempCo: X5R; Published: 2008-06-19; Publisher: Texas Instruments; LatestRevisionDate: 2017-06-22; ComponentLink1Description: Datasheet link; ComponentLink1URL: http://psearch.murata.com/capacitor/product/GRM188R61C475KAAJ%23.pdf; Supplier 1: Digi-Key; Supplier Part Number 1: 490-10481-1-ND; Supplier 2: Mouser; Supplier Part Number 2: 81-GRM188R61C475KAJD; AEC Qualified: N; AEC Grade: N/A; Green_EU RoHS: Passed; Green_EU RoHS-2: Incomplete
D1 = MMSZ4685T1G: Diode, Zener, 3.6 V, 500 mW, SOD-123; Manufacturer: ON Semiconductor; SymbolCreator: a0412235; U/M: EA; Power_W: 0.5; Vz_V: 3.6; Value1: 0.5W; RJA_CperW: 340; SizeAreaWB_mm2: 13.095; SizeArea_mm2: 6.545; SizeX_mm: 3.85; SizeY_mm: 1.7; SizeZ_mm: 1.35; AEC Category: Q101; Green_Lifecycle: Active; Green_REACh: Passed; SymbolVersion: 2010-08-25; PartNumber: MMSZ4685T1G; PackageReference: SOD-123; CompType: Zener; Vr_V: N/A; MountType: SMT; RoHS: Y; ComponentLink1Description: Datasheet link; ComponentLink1URL: http://www.onsemi.com/pub_link/Collateral/MMSZ4678T1-D.PDF; Published: 2008-10-08; Publisher: Texas Instruments; LatestRevisionDate: 2017-06-20; LatestRevisionNote: Updated Supplier Data; Supplier 1: Digi-Key; Supplier Part Number 1: MMSZ4685T1GOSCT-ND; Supplier 2: Mouser; Supplier Part Number 2: 863-MMSZ4685T1G; Supplier 3: Farnell; Supplier Part Number 3: 1651592; AEC Qualified: ?; Green_EU RoHS: Passed; Green_EU RoHS-2: Passed
D2-D10 D12-D15 = BZT52C5V6T-7: Diode, Zener, 5.6 V, 300 mW, SOD-523; Manufacturer: Diodes Inc.; SymbolCreator: a0412235; U/M: EA; Power_W: 0.3; Vz_V: 5.6; Value1: 0.3W; RJA_CperW: 417; SizeAreaWB_mm2: 5.13; SizeArea_mm2: 1.53; SizeX_mm: 1.7; SizeY_mm: 0.9; SizeZ_mm: 0.65; AEC Category: Q101; Green_Lifecycle: Active; Green_REACh: Passed; SymbolVersion: 2010-08-25; PartNumber: BZT52C5V6T-7; PackageReference: SOD-523; CompType: Zener; Vr_V: N/A; MountType: SMT; RoHS: Y; ComponentLink1Description: Datasheet link; ComponentLink1URL: http://www.diodes.com/datasheets/ds30502.pdf; Published: 2008-10-08; Publisher: Texas Instruments; LatestRevisionDate: 2017-06-20; LatestRevisionNote: Updated Supplier Data; Supplier 1: Digi-Key; Supplier Part Number 1: BZT52C5V6TDICT-ND; Supplier 2: Mouser; Supplier Part Number 2: 621-BZT52C5V6T-7; AEC Qualified: ?; Green_EU RoHS: Passed; Green_EU RoHS-2: Passed
D11 D17 D18 D20 = 1N4148W-7-F: Diode, Ultrafast, 100 V, 0.15 A, SOD-123; Manufacturer: Diodes Inc.; U/M: EA; Vf_V: 1.25; Value: 100V; Value1: 0.15A; Value2: 1.25V; Io_A: 0.15; Vr_V: 100; TJmax_C: 150; SizeAreaWB_mm2: 13.095; SizeArea_mm2: 6.545; SizeX_mm: 3.85; SizeY_mm: 1.7; SizeZ_mm: 1.35; AEC Category: Q101; Green_Lifecycle: Active; Green_REACh: Passed; SymbolVersion: 2008-12-08; PartNumber: 1N4148W-7-F; PackageReference: SOD-123; CompType: Diode; MountType: SMT; Type: Ultrafast; RoHS: Y; Published: 2008-06-26; Publisher: Texas Instruments; LatestRevisionDate: 2017-06-26; ComponentLink1Description: Datasheet link; ComponentLink1URL: http://www.diodes.com/datasheets/ds30086.pdf; Supplier 1: Digi-Key; Supplier Part Number 1: 1N4148W-FDICT-ND; Supplier 2: Mouser; Supplier Part Number 2: 621-1N4148W-F; Supplier 3: Farnell; Supplier Part Number 3: 1776392; AEC Qualified: ?; Green_EU RoHS: Passed; Green_EU RoHS-2: Passed
D16 = MMSZ5248B-7-F: Diode, Zener, 18 V, 500 mW, SOD-123; Manufacturer: Diodes Inc.; SymbolCreator: a0412235; U/M: EA; Power_W: 0.5; Vz_V: 18; Value1: 0.5W; RJA_CperW: 350; SizeAreaWB_mm2: 13.095; SizeArea_mm2: 6.545; SizeX_mm: 3.85; SizeY_mm: 1.7; SizeZ_mm: 1.35; AEC Category: Q101; Green_Lifecycle: Active; Green_REACh: Passed; SymbolVersion: 2010-08-25; PartNumber: MMSZ5248B-7-F; PackageReference: SOD-123; CompType: Zener; Vr_V: N/A; MountType: SMT; RoHS: Y; ComponentLink1Description: Datasheet link; ComponentLink1URL: http://www.diodes.com/datasheets/ds18010.pdf; Published: 2008-10-08; Publisher: Texas Instruments; LatestRevisionDate: 2017-06-20; LatestRevisionNote: Updated Supplier Data; Supplier 1: Digi-Key; Supplier Part Number 1: MMSZ5248B-FDICT-ND; Supplier 2: Mouser; Supplier Part Number 2: 621-MMSZ5248B-F; Supplier 3: Farnell; Supplier Part Number 3: 2061483; AEC Qualified: ?; Green_EU RoHS: Passed; Green_EU RoHS-2: Passed
D19 D22 = SBR0220T5-7: Diode, Super Barrier Rectifier, 20 V, 0.2 A, SOD-523; Manufacturer: Diodes Inc.; U/M: EA; Vf_V: 0.43; Value: 20V; Value1: 0.2A; Value2: 0.43V; Io_A: 0.2; Vr_V: 20; TJmax_C: 150; SizeAreaWB_mm2: 5.13; SizeArea_mm2: 1.53; SizeX_mm: 1.7; SizeY_mm: 0.9; SizeZ_mm: 0.65; AEC Category: Q101; Green_Lifecycle: Active; Green_REACh: Passed; SymbolVersion: 2008-12-08; PartNumber: SBR0220T5-7; PackageReference: SOD-523; CompType: Diode; MountType: SMT; Type: Super Barrier Rectifier; RoHS: Y; Published: 2008-06-26; Publisher: Texas Instruments; LatestRevisionDate: 2017-06-26; ComponentLink1Description: Datasheet link; ComponentLink1URL: http://www.diodes.com/datasheets/sbr/SBR0220T5.pdf; Supplier 1: Digi-Key; Supplier Part Number 1: SBR0220T5-7DICT-ND; Supplier 2: Mouser; Supplier Part Number 2: 621-SBR0220T5-7; AEC Qualified: ?; Green_EU RoHS: Passed; Green_EU RoHS-2: Passed
D21 = MMSZ5226BS-7-F: Diode, Zener, 3.3 V, 200 mW, SOD-323; Manufacturer: Diodes Inc.; SymbolCreator: a0412235; U/M: EA; Power_W: 0.2; Vz_V: 3.3; Value1: 0.2W; RJA_CperW: 350; SizeAreaWB_mm2: 8.695; SizeArea_mm2: 3.645; SizeX_mm: 2.7; SizeY_mm: 1.35; SizeZ_mm: 1; AEC Category: Q101; Green_Lifecycle: Active; Green_REACh: Passed; SymbolVersion: 2010-08-25; PartNumber: MMSZ5226BS-7-F; PackageReference: SOD-323; CompType: Zener; Vr_V: N/A; MountType: SMT; RoHS: Y; ComponentLink1Description: Datasheet link; ComponentLink1URL: http://www.diodes.com/datasheets/ds31038.pdf; Published: 2008-10-08; Publisher: Texas Instruments; LatestRevisionDate: 2017-06-20; LatestRevisionNote: Updated Supplier Data; Supplier 1: Digi-Key; Supplier Part Number 1: MMSZ5226BS-FDICT-ND; Supplier 2: Mouser; Supplier Part Number 2: 621-MMSZ5226BS-F; Supplier 3: Farnell; Supplier Part Number 3: 2061493; AEC Qualified: ?; Green_EU RoHS: Passed; Green_EU RoHS-2: Passed
Q1-Q13 = DMG2302UK-7: MOSFET, N-CH, 20 V, 2.8 A, AEC-Q101, SOT-23; Manufacturer: Diodes Inc.; Alternate Manufacturer: None; SymbolCreator: x0208325; U/M: EA; ChType: N; Value: 20V; VdsMax_V: 20; Value1: 0.09 ohm; Rdson45_ohm: 0.09; Value2: 1.4 nC; QgTyp_nC: 1.4; Vgs_V: 12; IdsMax_A: 2.8; SizeAreaWB_mm2: 14; SizeArea_mm2: 7.5; SizeX_mm: 2.5; SizeY_mm: 3; SizeZ_mm: 1.1; AEC Category: Q101; AEC Qualified: Y; Green_Lifecycle: Active; Green_REACh: Passed; SymbolVersion: 2013-11-21; PartNumber: DMG2302UK-7; PackageReference: SOT-23; CompType: MOSFET; RoHS: Y; MountType: SMT; Published: 2008-06-19; Publisher: Texas Instruments; LatestRevisionDate: 2017-06-26; LatestRevisionNote: Added parts.; ComponentLink1Description: Datasheet link; ComponentLink1URL: http://www.diodes.com/_files/datasheets/DMG2302UK.pdf; Supplier 1: Digi-Key; Supplier Part Number 1: DMG2302UK-7DICT-ND; Supplier 2: Mouser; Supplier Part Number 2: 621-DMG2302UK-7; Green_EU RoHS: Passed; Green_EU RoHS-2: Passed
Q14 = BSS123: MOSFET, N-CH, 100 V, 0.17 A, SOT-23; Manufacturer: Fairchild Semiconductor; Alternate Manufacturer: None; U/M: EA; ChType: N; Value: 100V; VdsMax_V: 100; Value1: 10 ohm; Rdson45_ohm: 10; Value2: 1.8 nC; QgTyp_nC: 1.8; Vgs_V: 20; IdsMax_A: 0.17; SizeAreaWB_mm2: 14; SizeArea_mm2: 7.5; SizeX_mm: 2.5; SizeY_mm: 3; SizeZ_mm: 1.1; AEC Category: Q101; Green_Lifecycle: Active; Green_REACh: Passed; SymbolVersion: 2008-07-28; CompType: MOSFET; PartNumber: BSS123; PackageReference: SOT-23; RoHS: Y; MountType: SMT; Published: 2008-06-19; Publisher: Texas Instruments; LatestRevisionDate: 2017-06-26; LatestRevisionNote: Added parts.; ComponentLink1Description: Datasheet link; ComponentLink1URL: http://www.fairchildsemi.com/ds/BS/BSS123.pdf; Supplier 1: Digi-Key; Supplier Part Number 1: BSS123NCT-ND; Supplier 2: Newark; Supplier Part Number 2: 58K8768; Supplier 3: Mouser; Supplier Part Number 3: 512-BSS123; AEC Qualified: ?; Green_EU RoHS: Passed; Green_EU RoHS-2: Passed
Q15 = ZXMP10A13FTA: MOSFET, P-CH, -100 V, -0.6 A, SOT-23; Manufacturer: Diodes Inc.; Alternate Manufacturer: None; U/M: EA; ChType: P; Value: -100V; Value1: 1 ohm; Rdson45_ohm: 1; Value2: 3.5 nC; QgTyp_nC: 3.5; Vgs_V: -4; SizeAreaWB_mm2: 14; SizeArea_mm2: 7.5; SizeX_mm: 2.5; SizeY_mm: 3; SizeZ_mm: 1.1; AEC Category: Q101; Green_Lifecycle: Active; Green_REACh: Passed; SymbolVersion: 2008-07-09; PartNumber: ZXMP10A13FTA; PackageReference: SOT-23; CompType: MOSFET; VdsMax_V: -100; IdsMax_A: -0.6; RoHS: Y; MountType: SMT; Published: 2008-06-19; Publisher: Texas Instruments; LatestRevisionDate: 2017-06-26; LatestRevisionNote: Added parts.; ComponentLink1Description: Datasheet link; ComponentLink1URL: http://www.diodes.com/datasheets/ZXMP10A13F.pdf; Supplier 1: Digi-Key; Supplier Part Number 1: ZXMP10A13FCT-ND; Supplier 2: Newark; Supplier Part Number 2: 12T2274; Supplier 3: Mouser; Supplier Part Number 3: 522-ZXMP10A13FTA; AEC Qualified: ?; Green_EU RoHS: Passed; Green_EU RoHS-2: Passed
R1-R10 R22-R29 R39-R46 = CRCW120680R6FKEA: RES, 80.6, 1%, 0.25 W, 1206; Manufacturer: Vishay-Dale; CompType: Resistor; Value: 80.6; Value_Code: 80R6; Tolerance_%: 1; Power_W: 0.25; Value2: 0.25W; VDC_V: 200; TempCo: 100 ppm/C; SizeArea_mm2: 5.12; SizeX_mm: 3.2; SizeY_mm: 1.6; SizeZ_mm: 1.35; EIA_Code: E96; U/M: EA; AEC Category: Q200; SymbolVersion: 2009-05-29; PartNumber: CRCW120680R6FKEA; PackageReference: 1206; RoHS: Y; Res_ohm: 80.6; Value1: 1%; MountType: SMT; Technology: Thick Film; Published: 2008-06-26; Publisher: Texas Instruments; LatestRevisionDate: 2017-06-12; ComponentLink1Description: Datasheet link; ComponentLink1URL: http://www.vishay.com/docs/20035/dcrcwe3.pdf; Supplier 1: Digi-Key; Supplier Part Number 1: 541-80.6FCT-ND; Supplier 2: Newark; Supplier Part Number 2: 53K2656; Supplier 3: Mouser; Supplier Part Number 3: 71-CRCW1206-80.6-E3; AEC Qualified: ?
R11-R16 R30-R34 R50-R54 R63-R65 = CRCW06031K00FKEA: RES, 1.00 k, 1%, 0.1 W, 0603; Manufacturer: Vishay-Dale; CompType: Resistor; Value: 1.00k; Res_ohm: 1000; Value_Code: 1k00; Tolerance_%: 1; Power_W: 0.1; Value2: 0.1W; VDC_V: 75; TempCo: 100 ppm/C; SizeArea_mm2: 1.28; SizeX_mm: 1.6; SizeY_mm: 0.8; EIA_Code: E96; U/M: EA; AEC Category: Q200; Green_Lifecycle: Active; Green_REACh: Passed; SymbolVersion: 2009-05-29; PartNumber: CRCW06031K00FKEA; PackageReference: 0603; RoHS: Y; Value1: 1%; MountType: SMT; Technology: Thick Film; SizeZ_mm: 1; Published: 2008-06-26; Publisher: Texas Instruments; LatestRevisionDate: 2017-06-13; ComponentLink1Description: Datasheet link; ComponentLink1URL: http://www.vishay.com/docs/20035/dcrcwe3.pdf; Supplier 1: Digi-Key; Supplier Part Number 1: 541-1.00KHCT-ND; Supplier 2: Newark; Supplier Part Number 2: 52K8015; Supplier 3: Mouser; Supplier Part Number 3: 71-CRCW0603-1.0K-E3; AEC Qualified: ?; Green_EU RoHS: Passed with Exemption; Green_EU RoHS-2: Passed
R17-R21 R35-R38 R55-R58 R66 = CRCW060310K0JNEA: RES, 10 k, 5%, 0.1 W, 0603; Manufacturer: Vishay-Dale; CompType: Resistor; Value: 10k; Res_ohm: 10000; Value_Code: 10k0; Tolerance_%: 5; Power_W: 0.1; Value2: 0.1W; VDC_V: 75; TempCo: 200 ppm/C; SizeArea_mm2: 1.28; SizeX_mm: 1.6; SizeY_mm: 0.8; SizeZ_mm: 1; EIA_Code: E24; U/M: EA; AEC Category: Q200; Green_Lifecycle: Active; Green_REACh: Passed; SymbolVersion: 2009-05-29; PartNumber: CRCW060310K0JNEA; PackageReference: 0603; RoHS: Y; Value1: 5%; MountType: SMT; Technology: Thick Film; Published: 2008-06-26; Publisher: Texas Instruments; LatestRevisionDate: 2017-06-13; ComponentLink1Description: Datasheet link; ComponentLink1URL: http://www.vishay.com/docs/20035/dcrcwe3.pdf; Supplier 1: Digi-Key; Supplier Part Number 1: 541-10KGCT-ND; Supplier 2: Newark; Supplier Part Number 2: 52K8066; Supplier 3: Mouser; Supplier Part Number 3: 71-CRCW0603J-10K-E3; AEC Qualified: ?; Green_EU RoHS: Passed with Exemption; Green_EU RoHS-2: Passed
R47 R49 = CRCW0603100KFKEA: RES, 100 k, 1%, 0.1 W, 0603; Manufacturer: Vishay-Dale; CompType: Resistor; Value: 100k; Res_ohm: 100000; Tolerance_%: 1; Power_W: 0.1; Value2: 0.1W; VDC_V: 75; TempCo: 100 ppm/C; SizeArea_mm2: 1.28; SizeX_mm: 1.6; SizeY_mm: 0.8; EIA_Code: E96; U/M: EA; AEC Category: Q200; Green_Lifecycle: Active; Green_REACh: Passed; SymbolVersion: 2009-05-29; PartNumber: CRCW0603100KFKEA; PackageReference: 0603; RoHS: Y; Value_Code: 100k; Value1: 1%; MountType: SMT; Technology: Thick Film; SizeZ_mm: 1; Published: 2008-06-26; Publisher: Texas Instruments; LatestRevisionDate: 2017-06-13; ComponentLink1Description: Datasheet link; ComponentLink1URL: http://www.vishay.com/docs/20035/dcrcwe3.pdf; Supplier 1: Digi-Key; Supplier Part Number 1: 541-100KHCT-ND; Supplier 2: Newark; Supplier Part Number 2: 42K3668; Supplier 3: Mouser; Supplier Part Number 3: 71-CRCW0603-100K-E3; AEC Qualified: ?; Green_EU RoHS: Passed with Exemption; Green_EU RoHS-2: Passed
R48 = CRCW0603200RFKEA: RES, 200, 1%, 0.1 W, 0603; Manufacturer: Vishay-Dale; CompType: Resistor; Value: 200; Value_Code: 200R; Tolerance_%: 1; Power_W: 0.1; Value2: 0.1W; VDC_V: 75; TempCo: 100 ppm/C; SizeArea_mm2: 1.28; SizeX_mm: 1.6; SizeY_mm: 0.8; EIA_Code: E96; U/M: EA; AEC Category: Q200; Green_Lifecycle: Active; Green_REACh: Passed; SymbolVersion: 2009-05-29; PartNumber: CRCW0603200RFKEA; PackageReference: 0603; RoHS: Y; Res_ohm: 200; Value1: 1%; MountType: SMT; Technology: Thick Film; SizeZ_mm: 1; Published: 2008-06-26; Publisher: Texas Instruments; LatestRevisionDate: 2017-06-13; ComponentLink1Description: Datasheet link; ComponentLink1URL: http://www.vishay.com/docs/20035/dcrcwe3.pdf; Supplier 1: Digi-Key; Supplier Part Number 1: 541-200HCT-ND; Supplier 2: Newark; Supplier Part Number 2: 52K8273; Supplier 3: Mouser; Supplier Part Number 3: 71-CRCW0603-200-E3; AEC Qualified: ?; Green_EU RoHS: Passed with Exemption; Green_EU RoHS-2: Passed
R59 = CRCW06031M00JNEA: RES, 1.0 M, 5%, 0.1 W, 0603; Manufacturer: Vishay-Dale; CompType: Resistor; Value: 1.0Meg; Res_ohm: 1000000; Value_Code: 1M00; Tolerance_%: 5; Power_W: 0.1; Value2: 0.1W; VDC_V: 75; TempCo: 200 ppm/C; SizeArea_mm2: 1.28; SizeX_mm: 1.6; SizeY_mm: 0.8; SizeZ_mm: 1; EIA_Code: E24; U/M: EA; AEC Category: Q200; Green_Lifecycle: Active; Green_REACh: Passed; SymbolVersion: 2009-05-29; PartNumber: CRCW06031M00JNEA; PackageReference: 0603; RoHS: Y; Value1: 5%; MountType: SMT; Technology: Thick Film; Published: 2008-06-26; Publisher: Texas Instruments; LatestRevisionDate: 2017-06-13; ComponentLink1Description: Datasheet link; ComponentLink1URL: http://www.vishay.com/docs/20035/dcrcwe3.pdf; Supplier 1: Digi-Key; Supplier Part Number 1: 541-1.0MGCT-ND; Supplier 2: Newark; Supplier Part Number 2: 59M6756; Supplier 3: Mouser; Supplier Part Number 3: 71-CRCW0603J-1.0M-E3; AEC Qualified: ?; Green_EU RoHS: Passed with Exemption; Green_EU RoHS-2: Passed
R60 = CRCW0603499KFKEA: RES, 499 k, 1%, 0.1 W, 0603; Manufacturer: Vishay-Dale; CompType: Resistor; Value: 499k; Res_ohm: 499000; Tolerance_%: 1; Power_W: 0.1; Value2: 0.1W; VDC_V: 75; TempCo: 100 ppm/C; SizeArea_mm2: 1.28; SizeX_mm: 1.6; SizeY_mm: 0.8; EIA_Code: E96; U/M: EA; AEC Category: Q200; Green_Lifecycle: Active; Green_REACh: Passed; SymbolVersion: 2009-05-29; PartNumber: CRCW0603499KFKEA; PackageReference: 0603; RoHS: Y; Value_Code: 499k; Value1: 1%; MountType: SMT; Technology: Thick Film; SizeZ_mm: 1; Published: 2008-06-26; Publisher: Texas Instruments; LatestRevisionDate: 2017-06-13; ComponentLink1Description: Datasheet link; ComponentLink1URL: http://www.vishay.com/docs/20035/dcrcwe3.pdf; Supplier 1: Digi-Key; Supplier Part Number 1: 541-499KHCT-ND; Supplier 2: Newark; Supplier Part Number 2: 52K8568; Supplier 3: Mouser; Supplier Part Number 3: 71-CRCW0603-499K-E3; AEC Qualified: ?; Green_EU RoHS: Passed with Exemption; Green_EU RoHS-2: Passed
R61 = CRCW0603100RFKEA: RES, 100, 1%, 0.1 W, 0603; Manufacturer: Vishay-Dale; CompType: Resistor; Value: 100; Value_Code: 100R; Tolerance_%: 1; Power_W: 0.1; Value2: 0.1W; VDC_V: 75; TempCo: 100 ppm/C; SizeArea_mm2: 1.28; SizeX_mm: 1.6; SizeY_mm: 0.8; EIA_Code: E96; U/M: EA; AEC Category: Q200; Green_Lifecycle: Active; Green_REACh: Passed; SymbolVersion: 2009-05-29; PartNumber: CRCW0603100RFKEA; PackageReference: 0603; RoHS: Y; Res_ohm: 100; Value1: 1%; MountType: SMT; Technology: Thick Film; SizeZ_mm: 1; Published: 2008-06-26; Publisher: Texas Instruments; LatestRevisionDate: 2017-06-13; ComponentLink1Description: Datasheet link; ComponentLink1URL: http://www.vishay.com/docs/20035/dcrcwe3.pdf; Supplier 1: Digi-Key; Supplier Part Number 1: 541-100HCT-ND; Supplier 2: Newark; Supplier Part Number 2: 52K8078; Supplier 3: Mouser; Supplier Part Number 3: 71-CRCW0603-100-E3; AEC Qualified: ?; Green_EU RoHS: Passed with Exemption; Green_EU RoHS-2: Passed
R62 = CRCW060310M0JNEA: RES, 10 M, 5%, 0.1 W, 0603; Manufacturer: Vishay-Dale; CompType: Resistor; Value: 10Meg; Res_ohm: 10000000; Value_Code: 10M0; Tolerance_%: 5; Power_W: 0.1; Value2: 0.1W; VDC_V: 75; TempCo: 200 ppm/C; SizeArea_mm2: 1.28; SizeX_mm: 1.6; SizeY_mm: 0.8; SizeZ_mm: 1; EIA_Code: E24; U/M: EA; AEC Category: Q200; Green_Lifecycle: Active; Green_REACh: Passed; SymbolVersion: 2009-05-29; PartNumber: CRCW060310M0JNEA; PackageReference: 0603; RoHS: Y; Value1: 5%; MountType: SMT; Technology: Thick Film; Published: 2008-06-26; Publisher: Texas Instruments; LatestRevisionDate: 2017-06-13; ComponentLink1Description: Datasheet link; ComponentLink1URL: http://www.vishay.com/docs/20035/dcrcwe3.pdf; Supplier 1: Digi-Key; Supplier Part Number 1: 541-10MGCT-ND; Supplier 2: Newark; Supplier Part Number 2: 59M6761; Supplier 3: Mouser; Supplier Part Number 3: 71-CRCW0603J-10M-E3; AEC Qualified: ?; Green_EU RoHS: Passed with Exemption; Green_EU RoHS-2: Passed
R67 = ERJ-3EKF3603V: RES, 360 k, 1%, 0.1 W, AEC-Q200 Grade 0, 0603; Manufacturer: Panasonic; CompType: Resistor; Value: 360k; Res_ohm: 360000; Tolerance_%: 1; Power_W: 0.1; Value2: 0.1W; VDC_V: 75; TempCo: 100 ppm/C; SizeArea_mm2: 1.28; SizeX_mm: 1.6; SizeY_mm: 0.8; U/M: EA; AEC Category: Q200; AEC Qualified: Y; AEC Grade: 0; Green_Lifecycle: Active; Green_REACh: Passed; SymbolVersion: 2009-05-29; PartNumber: ERJ-3EKF3603V; PackageReference: 0603; RoHS: Y; Value_Code: 360k; Value1: 1%; MountType: SMT; Technology: Thick Film; SizeZ_mm: 1; Published: 2008-06-26; Publisher: Texas Instruments; LatestRevisionDate: 2017-06-13; ComponentLink1Description: Datasheet link; ComponentLink1URL: http://industrial.panasonic.com/cdbs/www-data/pdf/RDA0000/AOA0000CE2.pdf; Supplier 1: Digi-Key; Supplier Part Number 1: P360KHCT-ND; Supplier 2: Newark; Supplier Part Number 2: 53W4607; Supplier 3: Mouser; Supplier Part Number 3: 667-ERJ-3EKF3603V; Green_EU RoHS: Passed with Exemption; Green_EU RoHS-2: Passed
R68 = CRCW06033K01FKEA: RES, 3.01 k, 1%, 0.1 W, 0603; Manufacturer: Vishay-Dale; CompType: Resistor; Value: 3.01k; Res_ohm: 3010; Value_Code: 3k01; Tolerance_%: 1; Power_W: 0.1; Value2: 0.1W; VDC_V: 75; TempCo: 100 ppm/C; SizeArea_mm2: 1.28; SizeX_mm: 1.6; SizeY_mm: 0.8; EIA_Code: E96; U/M: EA; AEC Category: Q200; Green_Lifecycle: Active; Green_REACh: Passed; SymbolVersion: 2009-05-29; PartNumber: CRCW06033K01FKEA; PackageReference: 0603; RoHS: Y; Value1: 1%; MountType: SMT; Technology: Thick Film; SizeZ_mm: 1; Published: 2008-06-26; Publisher: Texas Instruments; LatestRevisionDate: 2017-06-13; ComponentLink1Description: Datasheet link; ComponentLink1URL: http://www.vishay.com/docs/20035/dcrcwe3.pdf; Supplier 1: Digi-Key; Supplier Part Number 1: 541-3.01KHCT-ND; Supplier 2: Newark; Supplier Part Number 2: 52K8370; Supplier 3: Mouser; Supplier Part Number 3: 71-CRCW0603-3.01K-E3; AEC Qualified: ?; Green_EU RoHS: Passed with Exemption; Green_EU RoHS-2: Passed
RT1-RT3 = NTCALUG03A103G: Thermistor NTC, 10k ohm, 2%, NTC Thermistor, Mini Lug Sensor, Pitch 1.5mm; Manufacturer: Vishay-Bccomponents; Tolerance_%: 2; Power_W: 0.1; TaMin_C: -40; TaMax_C: 125; U/M: EA; CompType: ThermistorNTC; SymbolVersion: 2008-11-25; PartNumber: NTCALUG03A103G; Series: NTCALUG03; PackageReference: NTC Thermistor, Mini Lug Sensor, Pitch 1.5mm; MountType: TH; RoHS: Y; ComponentLink1Description: Datasheet link; ComponentLink1URL: http://www.vishay.com/docs/29114/ntcalug3.pdf; Published: 2009-09-22; Publisher: Texas Instruments; LatestRevisionDate: 2017-03-31; Supplier 1: Digi-Key; Supplier Part Number 1: BC2385-ND; Supplier 2: Newark; Supplier Part Number 2: 82T4011; Supplier 3: Mouser; Supplier Part Number 3: 594-NTCALUG03A103G
S1 = RS-032G05A3-SM RT: Switch, Tactile, SPST-NO, 0.05A, 12V, SMD; Manufacturer: C&K Components; SymbolCreator: a0799628; VDC_V: 12; SwitchFunction: Off-Mom; PositionCount: 1; CurrentRating_mA: 50; Green_Lifecycle: Not Set; Green_REACh: Incomplete; SymbolVersion: 2013-06-26; PartNumber: RS-032G05A3-SM RT; MountType: SMT; ComponentLink1Description: Datasheet URL; ComponentLink1URL: http://www.ck-components.com/83942/rs_18dec13.pdf/; RoHS: Y; Circuit: SPST-NO; Orientation: Top Actuated; CompType: Switch; PackageReference: SPST, 6x3.5mm; Publisher: Texas Instruments; LatestRevisionDate: 2017-06-14; Supplier 1: Digi-Key; Supplier Part Number 1: CKN10388CT-ND; Supplier 2: Mouser; Supplier Part Number 2: 611-RS-032G05A3-SMRT; Green_EU RoHS: Incomplete; Green_EU RoHS-2: Incomplete
U1 = CMP-0065910-1: 9 to 15-Series Cell Li-Ion and Li-Phosphate Battery Monitor (bq76940 Family), DBT0044A (TSSOP-44); Alternate Manufacturer: Texas Instruments; SizeAreaWB_mm2: 109.2; U/M: EA; SizeZ_mm: 1.2; SizeX_mm: 6.4; SizeY_mm: 11.0; SizeArea_mm2: 70.4; CompType: IC; ComponentLink1URL: http://www.ti.com/lit/gpn/bq76920; Alternate PartNumber: BQ7694003DBT; Publisher: Texas Instruments; PackageDescription: TSSOP-44; RoHS: Y; Footprint Path 6: C:\AltiumLibraries\Footprints\TI\.PcbLib; MountType: SMT; Manufacturer: Texas Instruments; PackageReference: DBT0044A; LatestRevisionDate: 2017-06-09; PartNumber: BQ7694003DBTR; ComponentLink1Description: Datasheet Link